# Altium project ESP8266.PrjPcb
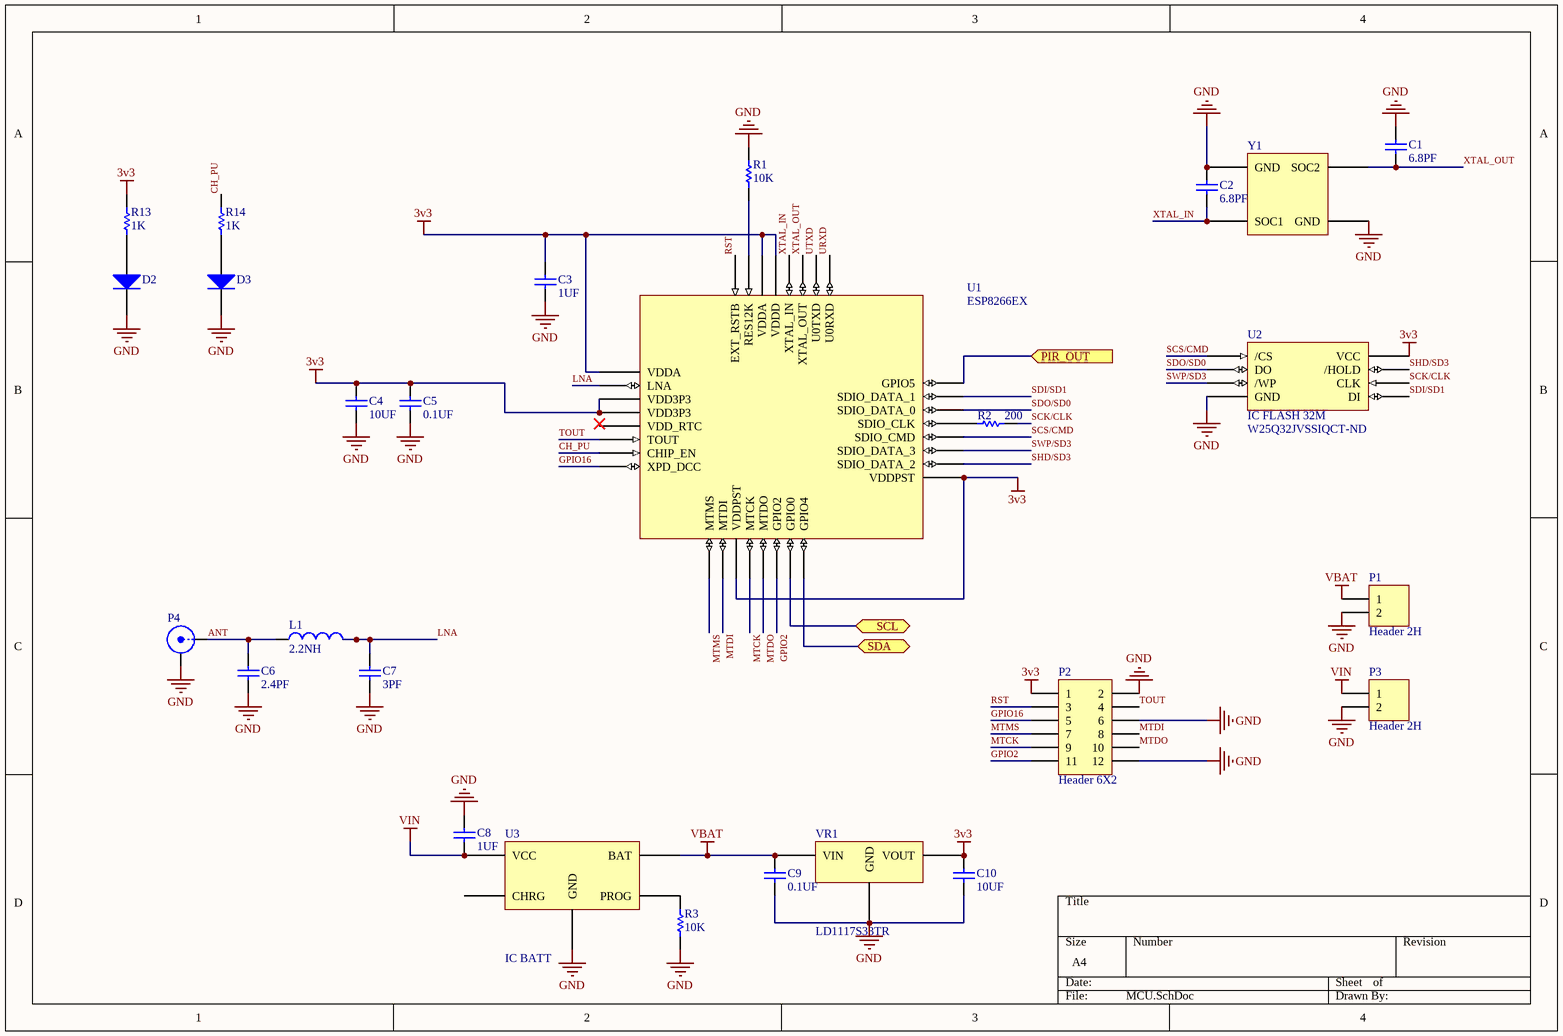
[diagram p0: MCU.SchDoc]
2 sheets, 50 parts. Net scope: flat (ports and power ports of the same name join across sheets).
Board file: ESP8266.PcbDoc
Sheets:
  MCU.SchDoc
  Sensor.SchDoc

## Sheet MCU.SchDoc
size A4

### Parts
C1  6.8PF  [Chip2PinSM127P600-8N-SAMSUNG-0603]
C2  6.8PF  [Chip2PinSM127P600-8N-SAMSUNG-0603]
C3  1UF  [Chip2PinSM127P600-8N-SAMSUNG-0603]
C4  10UF  [Chip2PinSM127P600-8N-SAMSUNG-0603]
C5  0.1UF  [Chip2PinSM127P600-8N-SAMSUNG-0603]
C6  2.4PF  [Chip2PinSM127P600-8N-SAMSUNG-0603]
C7  3PF  [Chip2PinSM127P600-8N-TDK_0603]
C8  1UF  [Chip2PinSM127P600-8N-SAMSUNG-0603]
C9  0.1UF  [Chip2PinSM127P600-8N-SAMSUNG-0603]
C10  10UF  [Chip2PinSM127P600-8N-SAMSUNG-0603]
D2  SML-D12M8WT86  [LED_0603_ROHM]  (value not drawn)
D3  SML-D12M8WT86  [LED_0603_ROHM]  (value not drawn)
L1  2.2NH  [Chip2PinSM127P600-8N-SAMSUNG-0603]
P1  Header 2H  [PCBComponent_1 - duplicate]
P2  Header 6X2  [HDR2X6]
P3  Header 2H  [PCBComponent_1 - duplicate]
P4  (no value)  [PCBComponent_1 - duplicate3]
R1  10K  [Chip2PinSM127P600-8N-vishay-0603]
R2  200  [Chip2PinSM127P600-8N-SAMSUNG-0603]
R3  10K  [Chip2PinSM127P600-8N-vishay-0603]
R13  1K  [Chip2PinSM127P600-8N-vishay-0603]
R14  1K  [Chip2PinSM127P600-8N-vishay-0603]
U1  ESP8266EX  [QFN127P600-8N]
U2  IC FLASH 32M  Supplier Part Number 1: W25Q32JVSSIQCT-ND  [SOIC127P600-8N-208]
U3  IC BATT  [SOT23127P600-8N-STC4054]
VR1  LD1117S33TR  [SOT230P700X180-4N_ST]
Y1  FA-128 26.0000MF10Z-W5  [PCBComponent_1]  (value not drawn)

### Ports
PIR_OUT (in), SCL (bidir), SDA (bidir)

### Nets
3v3: C3.1 C4.1 C5.2 C10.1 P2.1 R13.2 U1.1(VDDA) U1.3(VDD3P3) U1.4(VDD3P3) U1.11(VDDPST) U1.17(VDDPST) U1.29(VDDD) U1.30(VDDA) U2.8(VCC) VR1.2(VOUT)
GND: C1.2 C2.2 C3.2 C4.2 C5.1 C6.2 C7.2 C8.2 C9.2 C10.2 D2.2(K) D3.2(K) P1.2 P2.2 P2.6 P2.12 P3.2 P4.2(Y) R1.2 R3.2 U2.4(GND) U3.2(GND) VR1.1(GND) Y1.2(GND) Y1.4(GND)
VBAT: C9.1 P1.1 U3.3(BAT) VR1.3(VIN)
VIN: C8.1 P3.1 U3.4(VCC)
ANT: C6.1 L1.1 P4.1(X)
CH_PU: R14.2 U1.7(CHIP_EN)
GPIO2: P2.11 U1.14(GPIO2)
GPIO16: P2.5 U1.8(XPD_DCC)
LNA: C7.1 L1.2 U1.2(LNA)
MTCK: P2.9 U1.12(MTCK)
MTDI: P2.8 U1.10(MTDI)
MTDO: P2.10 U1.13(MTDO)
MTMS: P2.7 U1.9(MTMS)
RST: P2.3 U1.32(EXT_RSTB)
SCK/CLK: R2.2 U2.6(CLK)
SCS/CMD: U1.20(SDIO_CMD) U2.1(/CS)
SDI/SD1: U1.23(SDIO_DATA_1) U2.5(DI)
SDO/SD0: U1.22(SDIO_DATA_0) U2.2(DO)
SHD/SD3: U1.18(SDIO_DATA_2) U2.7(/HOLD)
SWP/SD3: U1.19(SDIO_DATA_3) U2.3(/WP)
TOUT: P2.4 U1.6(TOUT)
URXD: U1.25(U0RXD)
UTXD: U1.26(U0TXD)
XTAL_IN: C2.1 U1.28(XTAL_IN) Y1.1(SOC1)
XTAL_OUT: C1.1 U1.27(XTAL_OUT) Y1.3(SOC2)
NetD2_1: D2.1(A) R13.1
NetD3_1: D3.1(A) R14.1
NetR1_1: R1.1 U1.31(RES12K)
NetR2_1: R2.1 U1.21(SDIO_CLK)
NetR3_1: R3.1 U3.5(PROG)
NetR9_1: U1.16(GPIO4) ; port SDA
NetR10_1: U1.15(GPIO0) ; port SCL
NetU1_24: U1.24(GPIO5) ; port PIR_OUT

Not connected (* = marked no-connect by the designer): U1 5(VDD_RTC); U3 1(CHRG)

### Library data of the parts
C1 C2 = CL10C6R8DB8NNNC: CAP CER 6.8PF 50V C0G/NP0 0603; Manufacturer: Samsung Electro-Mechanics; Tolerance: ±0.5pF; Temperature Coefficient: C0G, NP0; Notification: Current market demand for these product types have resulted in fluctuating and extending lead times. Lead times may differ.; Supplier 1: Digi-Key; Manufacturer Part Number: CL10C6R8DB8NNNC; RoHS: RoHS Compliant; Category: Capacitors; Stock 1: 40000; Pricing 1: 1=0.08, 10=0.039, 100=0.0174, 500=0.01244, 1000=0.00978 (EUR); Packaging: Cut Tape (CT); Part Status: Active; Voltage - Rated: 50V; Operating Temperature: -55°C ~ 125°C; Features: -; Ratings: -; Applications: General Purpose; Mounting Type: Surface Mount, MLCC; Package / Case: 0603 (1608 Metric); Size / Dimension: 0.063" L x 0.031" W (1.60mm x 0.80mm); Height - Seated (Max): -; Thickness (Max): 0.035" (0.90mm); Lead Spacing: -; Lead Style: -; ComponentLink1URL: http://www.samsungsem.com/kr/support/product-search/mlcc/CL10C6R8DB8NNNC.jsp; ComponentLink1Description: http://www.samsungsem.com/kr/support/product-search/mlcc/CL10C6R8DB8NNNC.jsp; Supplier Part Number 1: 1276-2334-1-ND
C3 C8 = CL10B105KP8NNNC: CAP CER 1UF 10V X7R 0603; Manufacturer: Samsung Electro-Mechanics; Tolerance: ±10%; Notification: Current market demand for these product types have resulted in fluctuating and extending lead times. Lead times may differ.; Supplier 1: Digi-Key; Manufacturer Part Number: CL10B105KP8NNNC; RoHS: RoHS Compliant; Category: Capacitors; Stock 1: 40000; Pricing 1: 1=0.08, 10=0.044, 100=0.0197, 500=0.01408, 1000=0.01106 (EUR); Packaging: Cut Tape (CT); Part Status: Active; Voltage - Rated: 10V; Temperature Coefficient: X7R; Operating Temperature: -55°C ~ 125°C; Features: -; Ratings: -; Applications: General Purpose; Mounting Type: Surface Mount, MLCC; Package / Case: 0603 (1608 Metric); Size / Dimension: 0.063" L x 0.031" W (1.60mm x 0.80mm); Height - Seated (Max): -; Thickness (Max): 0.035" (0.90mm); Lead Spacing: -; Lead Style: -; ComponentLink1URL: http://www.samsungsem.com/kr/support/product-search/mlcc/CL10B105KP8NNNC.jsp; ComponentLink1Description: http://www.samsungsem.com/kr/support/product-search/mlcc/CL10B105KP8NNNC.jsp; Supplier Part Number 1: 1276-1946-1-ND
C4 C10 = CL10A106KQ8NNNC: CAP CER 10UF 6.3V X5R 0603; Manufacturer: Samsung Electro-Mechanics; Tolerance: ±10%; Notification: Current market demand for these product types have resulted in fluctuating and extending lead times. Lead times may differ.; Supplier 1: Digi-Key; Manufacturer Part Number: CL10A106KQ8NNNC; RoHS: RoHS Compliant; Category: Capacitors; Stock 1: 40000; Pricing 1: 1=0.25, 10=0.177, 100=0.1001, 500=0.07064, 1000=0.0618 (EUR); Packaging: Cut Tape (CT); Part Status: Active; Voltage - Rated: 6.3V; Temperature Coefficient: X5R; Operating Temperature: -55°C ~ 85°C; Features: -; Ratings: -; Applications: General Purpose; Mounting Type: Surface Mount, MLCC; Package / Case: 0603 (1608 Metric); Size / Dimension: 0.063" L x 0.031" W (1.60mm x 0.80mm); Height - Seated (Max): -; Thickness (Max): 0.035" (0.90mm); Lead Spacing: -; Lead Style: -; ComponentLink1URL: http://www.samsungsem.com/kr/support/product-search/mlcc/CL10A106KQ8NNNC.jsp; ComponentLink1Description: http://www.samsungsem.com/kr/support/product-search/mlcc/CL10A106KQ8NNNC.jsp; Supplier Part Number 1: 1276-1038-1-ND
C5 C9 = CL10F104ZO8NNNC: CAP CER 0.1UF 16V Y5V 0603; Manufacturer: Samsung Electro-Mechanics; Tolerance: -20%, +80%; Temperature Coefficient: Y5V (F); Notification: Current market demand for these product types have resulted in fluctuating and extending lead times. Lead times may differ.; Supplier 1: Digi-Key; Manufacturer Part Number: CL10F104ZO8NNNC; RoHS: RoHS Compliant; Category: Capacitors; Stock 1: 40000; Pricing 1: 1=0.08, 10=0.032, 100=0.0144, 500=0.01026, 1000=0.00806 (EUR); Packaging: Cut Tape (CT); Part Status: Active; Voltage - Rated: 16V; Operating Temperature: -30°C ~ 85°C; Features: -; Ratings: -; Applications: General Purpose; Mounting Type: Surface Mount, MLCC; Package / Case: 0603 (1608 Metric); Size / Dimension: 0.063" L x 0.031" W (1.60mm x 0.80mm); Height - Seated (Max): -; Thickness (Max): 0.035" (0.90mm); Lead Spacing: -; Lead Style: -; ComponentLink1URL: http://www.samsungsem.com/kr/support/product-search/mlcc/CL10F104ZO8NNNC.jsp; ComponentLink1Description: http://www.samsungsem.com/kr/support/product-search/mlcc/CL10F104ZO8NNNC.jsp; Supplier Part Number 1: 1276-1258-1-ND
C6 = CL10C2R4BB8NNNC: CAP CER 2.4PF 50V C0G/NP0 0603; Manufacturer: Samsung Electro-Mechanics; Tolerance: ±0.1pF; Temperature Coefficient: C0G, NP0; Notification: Current market demand for these product types have resulted in fluctuating and extending lead times. Lead times may differ.; Supplier 1: Digi-Key; Manufacturer Part Number: CL10C2R4BB8NNNC; RoHS: RoHS Compliant; Category: Capacitors; Stock 1: 40000; Pricing 1: 1=0.08, 10=0.034, 100=0.0151, 500=0.01074, 1000=0.00844 (EUR); Packaging: Cut Tape (CT); Part Status: Active; Voltage - Rated: 50V; Operating Temperature: -55°C ~ 125°C; Features: -; Ratings: -; Applications: General Purpose; Mounting Type: Surface Mount, MLCC; Package / Case: 0603 (1608 Metric); Size / Dimension: 0.063" L x 0.031" W (1.60mm x 0.80mm); Height - Seated (Max): -; Thickness (Max): 0.035" (0.90mm); Lead Spacing: -; Lead Style: -; ComponentLink1URL: http://www.samsungsem.com/kr/support/product-search/mlcc/CL10C2R4BB8NNNC.jsp; ComponentLink1Description: http://www.samsungsem.com/kr/support/product-search/mlcc/CL10C2R4BB8NNNC.jsp; Supplier Part Number 1: 1276-2254-1-ND
C7 = CL10C030BB8NNNC: CAP CER 3PF 50V C0G/NP0 0603; Manufacturer: Samsung Electro-Mechanics; Tolerance: ±0.1pF; Temperature Coefficient: C0G, NP0; Notification: Current market demand for these product types have resulted in fluctuating and extending lead times. Lead times may differ.; Supplier 1: Digi-Key; Manufacturer Part Number: CL10C030BB8NNNC; RoHS: RoHS Compliant; Category: Capacitors; Stock 1: 40000; Pricing 1: 1=0.08, 10=0.026, 100=0.0116, 500=0.00826, 1000=0.00649 (EUR); Packaging: Cut Tape (CT); Part Status: Active; Voltage - Rated: 50V; Operating Temperature: -55°C ~ 125°C; Features: -; Ratings: -; Applications: General Purpose; Mounting Type: Surface Mount, MLCC; Package / Case: 0603 (1608 Metric); Size / Dimension: 0.063" L x 0.031" W (1.60mm x 0.80mm); Height - Seated (Max): -; Thickness (Max): 0.035" (0.90mm); Lead Spacing: -; Lead Style: -; ComponentLink1URL: http://www.samsungsem.com/kr/support/product-search/mlcc/CL10C030BB8NNNC.jsp; ComponentLink1Description: http://www.samsungsem.com/kr/support/product-search/mlcc/CL10C030BB8NNNC.jsp; Supplier Part Number 1: 1276-2125-1-ND
D2 D3 = SML-D12M8WT86: LED GREEN DIFFUSED 0603 SMD; Manufacturer: Rohm Semiconductor; Configuration: Standard; Lens Color: White; Millicandela Rating: 25mcd; Lens Style: Rectangle with Flat Top; Lens Size: 1.20mm x 0.80mm; Voltage - Forward (Vf) (Typ): 2.2V; Current - Test: 20mA; Wavelength - Dominant: 572nm; Supplier 1: Digi-Key; Manufacturer Part Number: SML-D12M8WT86; RoHS: RoHS Compliant; Category: Optoelectronics; Stock 1: 315568; Pricing 1: 1=0.3, 10=0.219, 25=0.1616, 100=0.1154, 250=0.07848, 500=0.06926, 1000=0.05425 (EUR); Packaging: Cut Tape (CT); Part Status: Active; Color: Green; Lens Transparency: Diffused; Viewing Angle: -; Mounting Type: Surface Mount; Wavelength - Peak: -; Features: -; Package / Case: 0603 (1608 Metric); Supplier Device Package: 0603 (1608 Metric); Size / Dimension: 1.60mm L x 0.80mm W; Height (Max): 0.65mm; Base Part Number: SML-D12; ComponentLink1URL: https://www.rohm.com/datasheet/SML-D12V8W; ComponentLink1Description: https://www.rohm.com/datasheet/SML-D12V8W
L1 = L-14C2N2SV4T: FIXED IND 2.2NH 300MA 150 MOHM; Manufacturer: Johanson Technology Inc.; Type: Multilayer; Material - Core: Ceramic; Tolerance: ±0.3nH; Shielding: Unshielded; DC Resistance (DCR): 150 mOhm Max; Q @ Freq: 8 @ 100MHz; Frequency - Self Resonant: 12GHz; Supplier 1: Digi-Key; Manufacturer Part Number: L-14C2N2SV4T; RoHS: RoHS Compliant; Category: Inductors, Coils, Chokes; Stock 1: 17153; Pricing 1: 1=0.08, 10=0.052, 100=0.0348, 500=0.02898, 1000=0.02434 (EUR); Packaging: Cut Tape (CT); Part Status: Active; Current - Saturation: -; Ratings: -; Operating Temperature: -40°C ~ 100°C; Mounting Type: Surface Mount; Package / Case: 0603 (1608 Metric); Supplier Device Package: 0603 (1608 Metric); Size / Dimension: 0.063" L x 0.031" W (1.60mm x 0.80mm); Height - Seated (Max): 0.037" (0.95mm); ComponentLink1URL: https://media.digikey.com/pdf/Data%20Sheets/Johanson%20Technology/RF_Ceramic_Chip_Inductors.pdf; ComponentLink1Description: https://media.digikey.com/pdf/Data%20Sheets/Johanson%20Technology/RF_Ceramic_Chip_Inductors.pdf; Supplier Part Number 1: 712-1427-1-ND
P1 P3 = Header 2H: Header, 2-Pin, Right Angle; LatestRevisionDate: 17-Jul-2002; LatestRevisionNote: Re-released for DXP Platform.; Publisher: Altium Limited
P2 = Header 6X2: Header, 6-Pin, Dual row; LatestRevisionDate: 17-Jul-2002; LatestRevisionNote: Re-released for DXP Platform.; Publisher: Altium Limited
P4 = SMB: SMB Straight Connector; LatestRevisionDate: 17-Jul-2002; LatestRevisionNote: Re-released for DXP Platform.; Publisher: Altium Limited
R1 R3 = MCT06030C1002FP500: RES SMD 10K OHM 1% 1/8W 0603; Manufacturer: Vishay Beyschlag; Power (Watts): 0.125W, 1/8W; Temperature Coefficient: ±50ppm/°C; Supplier 1: Digi-Key; Manufacturer Part Number: MCT06030C1002FP500; RoHS: RoHS Compliant; Category: Resistors; Stock 1: 1201929; Pricing 1: 1=0.16, 10=0.133, 100=0.0521, 1000=0.02182, 2500=0.02 (EUR); Packaging: Cut Tape (CT); Part Status: Active; Tolerance: ±1%; Composition: Thin Film; Features: Anti-Sulfur; Operating Temperature: -55°C ~ 155°C; Package / Case: 0603 (1608 Metric); Supplier Device Package: 0603; Size / Dimension: 0.061" L x 0.033" W (1.55mm x 0.85mm); Height - Seated (Max): 0.022" (0.55mm); Failure Rate: -; ComponentLink1URL: http://www.vishay.com/docs/28705/mcx0x0xpro.pdf; ComponentLink1Description: http://www.vishay.com/docs/28705/mcx0x0xpro.pdf; Supplier Part Number 1: MCT0603-10.0K-CFCT-ND
R2 = RC1608F201CS: RES SMD 200 OHM 1% 1/10W 0603; Manufacturer: Samsung Electro-Mechanics; Power (Watts): 0.1W, 1/10W; Temperature Coefficient: ±100ppm/°C; Supplier 1: Digi-Key; Manufacturer Part Number: RC1608F201CS; RoHS: RoHS Compliant; Category: Resistors; Stock 1: 235074; Pricing 1: 1=0.08, 10=0.028, 100=0.0115, 1000=0.00516, 2500=0.00448 (EUR); Packaging: Cut Tape (CT); Part Status: Active; Tolerance: ±1%; Composition: Thick Film; Features: Moisture Resistant; Operating Temperature: -55°C ~ 155°C; Package / Case: 0603 (1608 Metric); Supplier Device Package: 0603; Size / Dimension: 0.063" L x 0.032" W (1.60mm x 0.80mm); Height - Seated (Max): 0.022" (0.55mm); Failure Rate: -; ComponentLink1URL: http://www.samsungsem.com/kr/support/product-search/chip-resistor/RC1608F201CS.jsp; ComponentLink1Description: http://www.samsungsem.com/kr/support/product-search/chip-resistor/RC1608F201CS.jsp; Supplier Part Number 1: 1276-4584-1-ND
R13 R14 = MCT06030C1001FP500: RES SMD 1K OHM 1% 1/8W 0603; Manufacturer: Vishay Beyschlag; Power (Watts): 0.125W, 1/8W; Temperature Coefficient: ±50ppm/°C; Supplier 1: Digi-Key; Manufacturer Part Number: MCT06030C1001FP500; RoHS: RoHS Compliant; Category: Resistors; Stock 1: 193422; Pricing 1: 1=0.16, 10=0.133, 100=0.0521, 1000=0.02182, 2500=0.02 (EUR); Packaging: Cut Tape (CT); Part Status: Active; Tolerance: ±1%; Composition: Thin Film; Features: Anti-Sulfur; Operating Temperature: -55°C ~ 155°C; Package / Case: 0603 (1608 Metric); Supplier Device Package: 0603; Size / Dimension: 0.061" L x 0.033" W (1.55mm x 0.85mm); Height - Seated (Max): 0.022" (0.55mm); Failure Rate: -; ComponentLink1URL: http://www.vishay.com/docs/28705/mcx0x0xpro.pdf; ComponentLink1Description: http://www.vishay.com/docs/28705/mcx0x0xpro.pdf; Supplier Part Number 1: MCT0603-1.00K-CFCT-ND
U1 = ESP8266EX: SMD IC ESP8266EX, QFN32-PIN, 5_5; Manufacturer: Espressif Systems; RF Family/Standard: WiFi; Protocol: 802.11b/g/n; Frequency: 2.4GHz; Data Rate (Max): 54Mbps; Power - Output: 20dBm; Sensitivity: -91dBm; Serial Interfaces: I²C, I²S, SPI, UART; Voltage - Supply: 2.5 V ~ 3.6 V; Current - Receiving: 50mA ~ 56mA; Current - Transmitting: 120mA ~ 170mA; Supplier 1: Digi-Key; Manufacturer Part Number: ESP8266EX; RoHS: RoHS Compliant; Category: RF/IF and RFID; Stock 1: 2122; Pricing 1: 1=2.49, 10=2.222, 25=2, 100=1.8223, 250=1.64452, 500=1.47562 (EUR); Packaging: Cut Tape (CT); Part Status: Active; Type: TxRx + MCU; Modulation: -; Memory Size: -; Package / Case: 32-VFQFN Exposed Pad; ComponentLink1URL: https://espressif.com/sites/default/files/documentation/0a-esp8266ex_datasheet_en.pdf; ComponentLink1Description: https://espressif.com/sites/default/files/documentation/0a-esp8266ex_datasheet_en.pdf; Supplier Part Number 1: 1904-1001-1-ND
U2 = W25Q32JVSSIQ TR: IC FLASH 32M SPI 133MHZ 8SOIC; Manufacturer: Winbond Electronics; Memory Type: Non-Volatile; Memory Size: 32Mb (4M x 8); Write Cycle Time - Word, Page: 3ms; Memory Interface: SPI - Quad I/O; Voltage - Supply: 2.7 V ~ 3.6 V; Supplier 1: Digi-Key; Manufacturer Part Number: W25Q32JVSSIQ TR; RoHS: RoHS Compliant; Category: Integrated Circuits (ICs); Stock 1: 102739; Pricing 1: 1=0.83, 10=0.753, 25=0.7428, 50=0.739, 100=0.6606, 250=0.65488, 500=0.64536, 750=0.63545, 1000=0.62208 (EUR); Packaging: Cut Tape (CT); Part Status: Active; Memory Format: FLASH; Technology: FLASH - NOR; Operating Temperature: -40°C ~ 85°C (TA); Mounting Type: Surface Mount; Package / Case: 8-SOIC (0.209", 5.30mm Width); Supplier Device Package: 8-SOIC; ComponentLink1URL: http://www.winbond.com/resource-files/w25q32jv%20revg%2003272018%20plus.pdf; ComponentLink1Description: http://www.winbond.com/resource-files/w25q32jv%20revg%2003272018%20plus.pdf
U3 = STC4054GR: IC BATT CHRGR 800MA TSOT23-5; Manufacturer: STMicroelectronics; Battery Chemistry: Lithium-Ion; Number of Cells: 1; Current - Charging: Constant - Programmable; Programmable Features: Current; Battery Pack Voltage: 4.2V; Voltage - Supply (Max): 6.5V; Supplier 1: Digi-Key; Manufacturer Part Number: STC4054GR; RoHS: RoHS Compliant; Category: Integrated Circuits (ICs); Stock 1: 11621; Pricing 1: 1=1.35, 10=1.208, 100=0.9707, 500=0.7975, 1000=0.66079 (EUR); Packaging: Digi-Reel®; Part Status: Active; Fault Protection: -; Charge Current - Max: 800mA; Interface: -; Operating Temperature: -40°C ~ 85°C (TA); Package / Case: SOT-23-5 Thin, TSOT-23-5; Supplier Device Package: TSOT-23-5; Base Part Number: STC4054; ComponentLink1URL: http://www.st.com/content/ccc/resource/technical/document/datasheet/df/b9/e6/5b/ec/92/45/ed/CD00132951.pdf/files/CD00132951.pdf/jcr:content/translations/en.CD00132951.pdf; ComponentLink1Description: http://www.st.com/content/ccc/resource/technical/document/datasheet/df/b9/e6/5b/ec/92/45/ed/CD00132951.pdf/files/CD00132951.pdf/jcr:content/translations/en.CD00132951.pdf; Supplier Part Number 1: 497-5809-6-ND
VR1 = LD1117S33TR: IC REG LINEAR 3.3V 800MA SOT223; Manufacturer: STMicroelectronics; Output Configuration: Positive; Output Type: Fixed; Voltage - Input (Max): 15V; Voltage Dropout (Max): 1.2V @ 800mA; PSRR: 75dB (120Hz); Protection Features: Over Current, Over Temperature; Supplier 1: Digi-Key; Manufacturer Part Number: LD1117S33TR; RoHS: RoHS Compliant; Category: Integrated Circuits (ICs); Stock 1: 10; Pricing 1: 1=0.37, 10=0.316, 100=0.2358, 500=0.18526, 1000=0.14317 (EUR); Packaging: Cut Tape (CT); Part Status: Active; Voltage - Output (Min/Fixed): 3.3V; Voltage - Output (Max): -; Current - Output: 800mA; Control Features: -; Operating Temperature: 0°C ~ 125°C; Mounting Type: Surface Mount; Package / Case: TO-261-4, TO-261AA; Supplier Device Package: SOT-223; Base Part Number: LD1117; ComponentLink1URL: http://www.st.com/content/ccc/resource/technical/document/datasheet/99/3b/7d/91/91/51/4b/be/CD00000544.pdf/files/CD00000544.pdf/jcr:content/translations/en.CD00000544.pdf; ComponentLink1Description: http://www.st.com/content/ccc/resource/technical/document/datasheet/99/3b/7d/91/91/51/4b/be/CD00000544.pdf/files/CD00000544.pdf/jcr:content/translations/en.CD00000544.pdf; Supplier Part Number 1: 497-1242-1-ND
Y1 = FA-128 26.0000MF10Z-W5: CRYSTAL 26.0000MHZ 12PF SMD; Manufacturer: EPSON; Frequency Stability: ±10ppm; Operating Mode: Fundamental; Supplier 1: Digi-Key; Manufacturer Part Number: FA-128 26.0000MF10Z-W5; RoHS: RoHS Compliant; Category: Crystals, Oscillators, Resonators; Stock 1: 200409; Pricing 1: 1=0.5, 10=0.419, 50=0.3772, 100=0.3353, 500=0.3185, 1000=0.2682 (EUR); Packaging: Cut Tape (CT); Part Status: Active; Type: MHz Crystal; Frequency Tolerance: ±10ppm; Load Capacitance: 12pF; Operating Temperature: -20°C ~ 75°C; Ratings: -; Mounting Type: Surface Mount; Package / Case: 4-SMD, No Lead; Size / Dimension: 0.079" L x 0.063" W (2.00mm x 1.60mm); Height - Seated (Max): 0.020" (0.50mm); ComponentLink1URL: https://support.epson.biz/td/api/doc_check.php?dl=brief_FA-128&lang=en; ComponentLink1Description: https://support.epson.biz/td/api/doc_check.php?dl=brief_FA-128&lang=en; Supplier Part Number 1: SER4186CT-ND

## Sheet Sensor.SchDoc
size A4
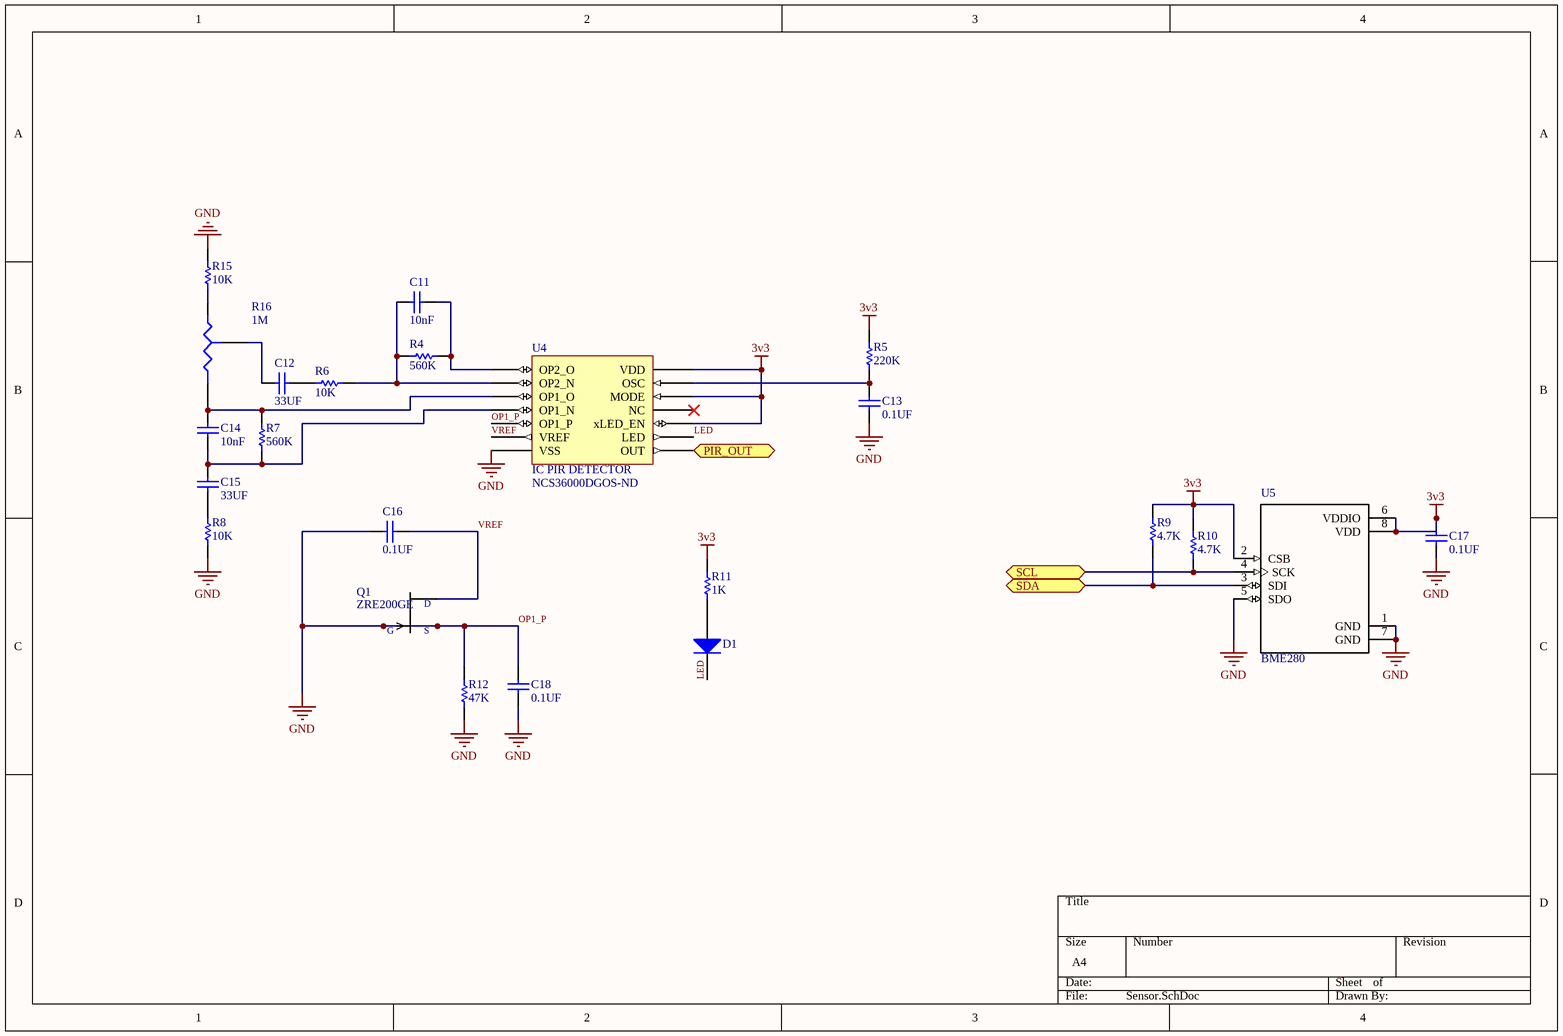
[diagram p1: Sensor.SchDoc]

### Parts
C11  10nF  [Chip2PinSM127P600-8N-SAMSUNG-0603]
C12  33UF  [Chip2PinSM127P600-8N-TDK_0603]
C13  0.1UF  [Chip2PinSM127P600-8N-SAMSUNG-0603]
C14  10nF  [Chip2PinSM127P600-8N-SAMSUNG-0603]
C15  33UF  [Chip2PinSM127P600-8N-TDK_0603]
C16  0.1UF  [Chip2PinSM127P600-8N-SAMSUNG-0603]
C17  0.1UF  [Chip2PinSM127P600-8N-SAMSUNG-0603]
C18  0.1UF  [Chip2PinSM127P600-8N-SAMSUNG-0603]
D1  SML-D12M8WT86  [LED_0603_ROHM]  (value not drawn)
Q1  ZRE200GE  [TO5]
R4  560K  [Chip2PinSM127P600-8N-Stackpole-0603]
R5  220K  [Chip2PinSM127P600-8N-vishay-0603]
R6  10K  [Chip2PinSM127P600-8N-vishay-0603]
R7  560K  [Chip2PinSM127P600-8N-Stackpole-0603]
R8  10K  [Chip2PinSM127P600-8N-vishay-0603]
R9  4.7K  [Chip2PinSM127P600-8N-vishay-0603]
R10  4.7K  [Chip2PinSM127P600-8N-vishay-0603]
R11  1K  [Chip2PinSM127P600-8N-vishay-0603]
R12  47K  [Chip2PinSM127P600-8N-0603-te]
R15  10K  [Chip2PinSM127P600-8N-vishay-0603]
R16  value 1M  [PCBComponent_1 - duplicate1]
U4  IC PIR DETECTOR  Supplier Part Number 1: NCS36000DGOS-ND  [SOIC127P600-8N-PIRIC_NCS36000]
U5  BME280  [PSON65P250X250X100-8N]

### Ports
PIR_OUT (out), SCL (bidir), SDA (bidir)

### Nets
3v3: C17.2 R5.2 R9.2 R10.2 R11.2 U4.10(xLED_EN) U4.12(MODE) U4.14(VDD) U5.2(CSB) U5.6(VDDIO) U5.8(VDD)
GND: C13.2 C16.1 C17.1 C18.2 Q1.3(G) R8.2 R12.1 R15.1 U4.7(VSS) U5.1(GND) U5.5(SDO) U5.7(GND)
LED: D1.2(K) U4.9(LED)
OP1_P: C18.1 Q1.2(S) R12.2 U4.5(OP1_P)
VREF: C16.2 Q1.1(D) U4.6(VREF)
NetC11_1: C11.1 R4.1 R6.2 U4.2(OP2_N)
NetC11_2: C11.2 R4.2 U4.1(OP2_O)
NetC12_1: C12.1 R16.3(TAP)
NetC12_2: C12.2 R6.1
NetC13_1: C13.1 R5.1 U4.13(OSC)
NetC14_1: C14.1 R7.2 R16.2(B) U4.3(OP1_O)
NetC14_2: C14.2 C15.2 R7.1 U4.4(OP1_N)
NetC15_1: C15.1 R8.1
NetD1_1: D1.1(A) R11.1
NetR9_1: R9.1 U5.3(SDI) ; port SDA
NetR10_1: R10.1 U5.4(SCK) ; port SCL
NetR15_2: R15.2 R16.1(A)
NetU1_24: U4.8(OUT) ; port PIR_OUT

Not connected (* = marked no-connect by the designer): U4 11(NC)*

### Library data of the parts
C11 C14 = CL10B103KB8NCNC: CAP CER 10000PF 50V X7R 0603; Manufacturer: Samsung Electro-Mechanics; Tolerance: ±10%; Supplier 1: Digi-Key; Manufacturer Part Number: CL10B103KB8NCNC; RoHS: RoHS Compliant; Category: Capacitors; Stock 1: 1066876; Pricing 1: 1=0.09, 10=0.029, 100=0.0129, 500=0.00926, 1000=0.00728 (EUR); Packaging: Cut Tape (CT); Part Status: Active; Voltage - Rated: 50V; Temperature Coefficient: X7R; Operating Temperature: -55°C ~ 125°C; Features: -; Ratings: -; Applications: General Purpose; Mounting Type: Surface Mount, MLCC; Package / Case: 0603 (1608 Metric); Size / Dimension: 0.063" L x 0.031" W (1.60mm x 0.80mm); Height - Seated (Max): -; Thickness (Max): 0.035" (0.90mm); Lead Spacing: -; Lead Style: -; ComponentLink1URL: http://www.samsungsem.com/kr/support/product-search/mlcc/CL10B103KB8NCNC.jsp; ComponentLink1Description: http://www.samsungsem.com/kr/support/product-search/mlcc/CL10B103KB8NCNC.jsp; Supplier Part Number 1: 1276-1921-1-ND
C12 C15 = C2012X5R0J336M125AC: CAP CER 33UF 6.3V X5R 0805; Manufacturer: TDK Corporation; Tolerance: ±20%; Notification: Current market demand for these product types have resulted in fluctuating and extending lead times. Lead times may differ.; Supplier 1: Digi-Key; Manufacturer Part Number: C2012X5R0J336M125AC; RoHS: RoHS Compliant; Category: Capacitors; Stock 1: 20000; Pricing 1: 1=0.86, 10=0.654, 100=0.4676, 500=0.362, 1000=0.31172 (EUR); Packaging: Digi-Reel®; Part Status: Active; Voltage - Rated: 6.3V; Temperature Coefficient: X5R; Operating Temperature: -55°C ~ 85°C; Features: Low ESL; Ratings: -; Applications: General Purpose; Failure Rate: -; Mounting Type: Surface Mount, MLCC; Package / Case: 0805 (2012 Metric); Size / Dimension: 0.079" L x 0.049" W (2.00mm x 1.25mm); Height - Seated (Max): -; Thickness (Max): 0.057" (1.45mm); Lead Spacing: -; Lead Style: -; ComponentLink1URL: https://product.tdk.com/info/en/catalog/datasheets/mlcc_commercial_general_en.pdf; ComponentLink1Description: https://product.tdk.com/info/en/catalog/datasheets/mlcc_commercial_general_en.pdf; Supplier Part Number 1: 445-5986-6-ND
C13 C16-C18 = CL10F104ZO8NNNC: as C5 on sheet MCU; Supplier 1: Digi-Key; Manufacturer Part Number: CL10F104ZO8NNNC; RoHS: RoHS Compliant; Category: Capacitors; Stock 1: 40000; Pricing 1: 1=0.08, 10=0.032, 100=0.0144, 500=0.01026, 1000=0.00806 (EUR); Packaging: Cut Tape (CT); Part Status: Active; Voltage - Rated: 16V; Operating Temperature: -30°C ~ 85°C; Features: -; Ratings: -; Applications: General Purpose; Mounting Type: Surface Mount, MLCC; Package / Case: 0603 (1608 Metric); Size / Dimension: 0.063" L x 0.031" W (1.60mm x 0.80mm); Height - Seated (Max): -; Thickness (Max): 0.035" (0.90mm); Lead Spacing: -; Lead Style: -; ComponentLink1URL: http://www.samsungsem.com/kr/support/product-search/mlcc/CL10F104ZO8NNNC.jsp; ComponentLink1Description: http://www.samsungsem.com/kr/support/product-search/mlcc/CL10F104ZO8NNNC.jsp; Supplier Part Number 1: 1276-1258-1-ND
D1 = SML-D12M8WT86: as D2 on sheet MCU; Supplier 1: Digi-Key; Manufacturer Part Number: SML-D12M8WT86; RoHS: RoHS Compliant; Category: Optoelectronics; Stock 1: 315568; Pricing 1: 1=0.3, 10=0.219, 25=0.1616, 100=0.1154, 250=0.07848, 500=0.06926, 1000=0.05425 (EUR); Packaging: Cut Tape (CT); Part Status: Active; Color: Green; Lens Transparency: Diffused; Viewing Angle: -; Mounting Type: Surface Mount; Wavelength - Peak: -; Features: -; Package / Case: 0603 (1608 Metric); Supplier Device Package: 0603 (1608 Metric); Size / Dimension: 1.60mm L x 0.80mm W; Height (Max): 0.65mm; Base Part Number: SML-D12; ComponentLink1URL: https://www.rohm.com/datasheet/SML-D12V8W; ComponentLink1Description: https://www.rohm.com/datasheet/SML-D12V8W
Q1 = ZRE200GE: Zmotion Pir Sensor Dual Element; MF: Zilog; MP: ZRE200GE; SnapEDA_Link: https://www.snapeda.com/parts/ZRE200GE/Zilog/view-part/?ref=snap; Digi-Key_Part_Number: 269-4955-ND; Digi-Key_Purchase_URL: https://www.digikey.com/product-detail/en/zilog/ZRE200GE/269-4955-ND/5147335?utm_source=snapeda&utm_medium=aggregator&utm_campaign=symbol; Package: TO-5-3 Zilog; Value: *
R4 R7 = ERJ-3EKF5603V: RES SMD 560K OHM 1% 1/10W 0603; Manufacturer: Panasonic Electronic Components; Power (Watts): 0.1W, 1/10W; Temperature Coefficient: ±100ppm/°C; Supplier 1: Digi-Key; Manufacturer Part Number: ERJ-3EKF5603V; RoHS: RoHS Compliant; Category: Resistors; Stock 1: 221508; Pricing 1: 1=0.09, 10=0.057, 100=0.0231, 1000=0.01037, 2500=0.009 (EUR); Packaging: Cut Tape (CT); Part Status: Active; Tolerance: ±1%; Composition: Thick Film; Features: Automotive AEC-Q200; Operating Temperature: -55°C ~ 155°C; Package / Case: 0603 (1608 Metric); Supplier Device Package: 0603; Size / Dimension: 0.063" L x 0.032" W (1.60mm x 0.80mm); Height - Seated (Max): 0.022" (0.55mm); Failure Rate: -; ComponentLink1URL: https://industrial.panasonic.com/cdbs/www-data/pdf/RDA0000/AOA0000C304.pdf; ComponentLink1Description: https://industrial.panasonic.com/cdbs/www-data/pdf/RDA0000/AOA0000C304.pdf; Supplier Part Number 1: P560KHCT-ND
R5 = CRCW0603220KFKEAC: RES SMD 220K OHM 1% 1/10W 0603; Manufacturer: Vishay Dale; Power (Watts): 0.1W, 1/10W; Temperature Coefficient: ±100ppm/°C; Supplier 1: Digi-Key; Manufacturer Part Number: CRCW0603220KFKEAC; RoHS: RoHS Compliant; Category: Resistors; Stock 1: 154470; Pricing 1: 1=0.09, 10=0.026, 100=0.0108, 1000=0.00484, 2500=0.0042 (EUR); Packaging: Cut Tape (CT); Part Status: Active; Tolerance: ±1%; Composition: Thick Film; Features: -; Operating Temperature: -55°C ~ 155°C; Package / Case: 0603 (1608 Metric); Supplier Device Package: 0603; Height - Seated (Max): 0.022" (0.55mm); Failure Rate: -; ComponentLink1URL: http://www.vishay.com/docs/28773/crcwce3.pdf; ComponentLink1Description: http://www.vishay.com/docs/28773/crcwce3.pdf; Supplier Part Number 1: 541-4039-1-ND
R6 R8 R15 = MCT06030C1002FP500: as R1 on sheet MCU; Supplier 1: Digi-Key; Manufacturer Part Number: MCT06030C1002FP500; RoHS: RoHS Compliant; Category: Resistors; Stock 1: 1201929; Pricing 1: 1=0.16, 10=0.133, 100=0.0521, 1000=0.02182, 2500=0.02 (EUR); Packaging: Cut Tape (CT); Part Status: Active; Tolerance: ±1%; Composition: Thin Film; Features: Anti-Sulfur; Operating Temperature: -55°C ~ 155°C; Package / Case: 0603 (1608 Metric); Supplier Device Package: 0603; Size / Dimension: 0.061" L x 0.033" W (1.55mm x 0.85mm); Height - Seated (Max): 0.022" (0.55mm); Failure Rate: -; ComponentLink1URL: http://www.vishay.com/docs/28705/mcx0x0xpro.pdf; ComponentLink1Description: http://www.vishay.com/docs/28705/mcx0x0xpro.pdf; Supplier Part Number 1: MCT0603-10.0K-CFCT-ND
R9 R10 = CRCW06034K70JNEAC: RES SMD 4.7K OHM 5% 1/10W 0603; Manufacturer: Vishay Dale; Power (Watts): 0.1W, 1/10W; Temperature Coefficient: ±200ppm/°C; Supplier 1: Digi-Key; Manufacturer Part Number: CRCW06034K70JNEAC; RoHS: RoHS Compliant; Category: Resistors; Stock 1: 819006; Pricing 1: 1=0.09, 10=0.019, 100=0.008, 1000=0.00357, 2500=0.0031 (EUR); Packaging: Digi-Reel®; Part Status: Active; Tolerance: ±5%; Composition: Thick Film; Features: -; Operating Temperature: -55°C ~ 155°C; Package / Case: 0603 (1608 Metric); Supplier Device Package: 0603; Height - Seated (Max): 0.022" (0.55mm); Failure Rate: -; ComponentLink1URL: http://www.vishay.com/docs/28773/crcwce3.pdf; ComponentLink1Description: http://www.vishay.com/docs/28773/crcwce3.pdf; Supplier Part Number 1: 541-3993-6-ND
R11 = MCT06030C1001FP500: as R13 on sheet MCU; Supplier 1: Digi-Key; Manufacturer Part Number: MCT06030C1001FP500; RoHS: RoHS Compliant; Category: Resistors; Stock 1: 193422; Pricing 1: 1=0.16, 10=0.133, 100=0.0521, 1000=0.02182, 2500=0.02 (EUR); Packaging: Cut Tape (CT); Part Status: Active; Tolerance: ±1%; Composition: Thin Film; Features: Anti-Sulfur; Operating Temperature: -55°C ~ 155°C; Package / Case: 0603 (1608 Metric); Supplier Device Package: 0603; Size / Dimension: 0.061" L x 0.033" W (1.55mm x 0.85mm); Height - Seated (Max): 0.022" (0.55mm); Failure Rate: -; ComponentLink1URL: http://www.vishay.com/docs/28705/mcx0x0xpro.pdf; ComponentLink1Description: http://www.vishay.com/docs/28705/mcx0x0xpro.pdf; Supplier Part Number 1: MCT0603-1.00K-CFCT-ND
R12 = CRGCQ0603F47K: CRGCQ 0603 47K 1%; Manufacturer: TE Connectivity Passive Product; Power (Watts): 0.1W, 1/10W; Temperature Coefficient: ±100ppm/°C; Supplier 1: Digi-Key; Manufacturer Part Number: CRGCQ0603F47K; RoHS: RoHS Compliant; Category: Resistors; Stock 1: 50; Pricing 1: 1=0.09, 10=0.026, 100=0.0106, 1000=0.00474, 2500=0.00411 (EUR); Packaging: Cut Tape (CT); Part Status: Active; Tolerance: ±1%; Composition: Thick Film; Features: Automotive AEC-Q200, Moisture Resistant; Operating Temperature: -55°C ~ 155°C; Package / Case: 0603 (1608 Metric); Supplier Device Package: 0603; Size / Dimension: 0.063" L x 0.031" W (1.60mm x 0.80mm); Height - Seated (Max): 0.022" (0.55mm); Failure Rate: -; ComponentLink1URL: https://www.te.com/commerce/DocumentDelivery/DDEController?Action=srchrtrv&DocNm=1773204-3&DocType=DS&DocLang=English; ComponentLink1Description: https://www.te.com/commerce/DocumentDelivery/DDEController?Action=srchrtrv&DocNm=1773204-3&DocType=DS&DocLang=English; Supplier Part Number 1: A129708CT-ND
R16 = Res Tap: Tapped Resistor; Manufacturer: Bourns Inc.; Manufacturer Part Number: TC33X-2-105E; Sim Note: Enter the Resistance value and the set point into parameter fields.; Set Position: 0.5; Power (Watts): 0.1W, 1/10W; Tolerance: ±25%; Temperature Coefficient: ±250ppm/°C; Adjustment Type: Top Adjustment; Resistive Material: Cermet; Published: 24-Mar-1999; LatestRevisionDate: 17-Jul-2002; LatestRevisionNote: Re-released for DXP Platform.; PackageReference: VR3; Publisher: Altium Limited; PackageDescription: Variable Resistor, Thru-Hole; 3 Leads; Supplier 1: Digi-Key; Supplier Part Number 1: TC33X-2-105ECT-ND; RoHS: RoHS Compliant; Category: Potentiometers, Variable Resistors; Stock 1: 32075; Pricing 1: 1=0.24, 10=0.242, 25=0.2188, 50=0.2088, 100=0.202, 250=0.18852, 500=0.1717, 1000=0.15486 (EUR); Packaging: Cut Tape (CT); Part Status: Active; Mounting Type: Surface Mount; Termination Style: J Lead; Size / Dimension: Rectangular - 0.150" x 0.142" Face x 0.047" H (3.80mm x 3.60mm x 1.20mm); ComponentLink1URL: https://www.bourns.com/docs/Product-Datasheets/TC33.pdf; ComponentLink1Description: https://www.bourns.com/docs/Product-Datasheets/TC33.pdf
U4 = NCS36000DG: IC PIR DETECTOR CTLR 14SOIC; Manufacturer: ON Semiconductor; Input Type: Digital; Interface: CMOS; Supplier 1: Digi-Key; Manufacturer Part Number: NCS36000DG; RoHS: RoHS Compliant; Category: Integrated Circuits (ICs); Stock 1: 566; Pricing 1: 1=0.75, 55=0.63655, 110=0.52291, 550=0.43195, 1045=0.34101 (EUR); Packaging: Tray; Part Status: Active; Type: Detector Controller; Output Type: Digital; Operating Temperature: -40°C ~ 85°C; Mounting Type: Surface Mount; Package / Case: 14-SOIC (0.154", 3.90mm Width); Supplier Device Package: 14-SOIC; Base Part Number: NCS36000; ComponentLink1URL: http://www.onsemi.com/pub/Collateral/NCS36000-D.PDF; ComponentLink1Description: http://www.onsemi.com/pub/Collateral/NCS36000-D.PDF
U5 = BME280: Integrated pressure, humidity and temperature sensor; 8-pin 2.5x2.5x0.93mm LGA; MF: Bosch; MP: BME280; SnapEDA_Link: https://www.snapeda.com/parts/BME280/Bosch%20Sensortec/view-part/?ref=snap; Digi-Key_Part_Number: 828-1063-1-ND; Digi-Key_Purchase_URL: https://www.digikey.es/product-detail/en/bosch-sensortec/BME280/828-1063-1-ND/6136314?utm_source=snapeda&utm_medium=aggregator&utm_campaign=symbol; Package: LGA-8 Bosch; Value: *

## Nets that join several sheets
3v3: MCU (15 pins), Sensor (11 pins)
GND: MCU (25 pins), Sensor (12 pins)
NetR9_1: MCU (U1.16), Sensor (R9.1 U5.3)
NetR10_1: MCU (U1.15), Sensor (R10.1 U5.4)
NetU1_24: MCU (U1.24), Sensor (U4.8)